# Altium schematic sheet IP2315.SchDoc
size A4
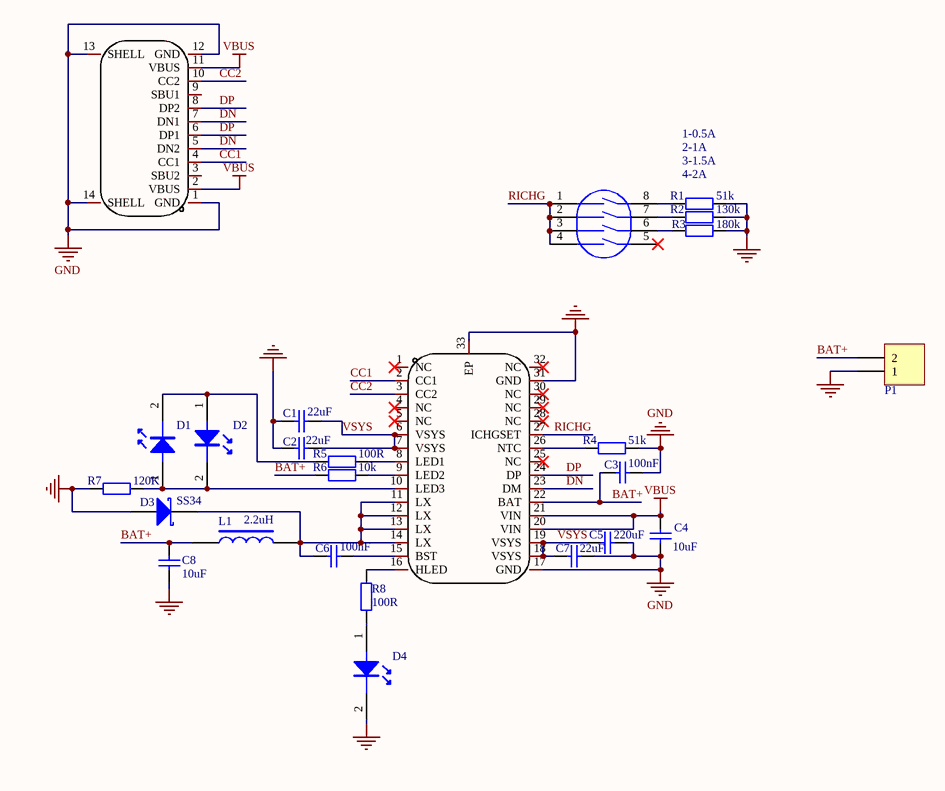
[diagram p0: IP2315.SchDoc]

## Parts
C1  value 22uF  [0805C]  (hidden comment: Cap)
C2  value 22uF  [0805C]  (hidden comment: Cap)
C3  value 100nF  [C0603]  (hidden comment: Cap)
C4  value 10uF  [0805C]  (hidden comment: Cap)
C5  value 220uF  [CAP-SMD_BD6.3-L6.6-W6.6-LS7.4-FD]  (hidden comment: Cap)
C6  value 100nF  [C0603]  (hidden comment: Cap)
C7  value 22uF  [0805C]  (hidden comment: Cap)
C8  value 10uF  [0805C]  (hidden comment: Cap)
D1  Green  [LED0603-RD_RED]  (value not drawn)
D2  Green  [LED0603-RD_RED]  (value not drawn)
D3  SS34  [SMA_L4.3-W2.5-LS5.0-RD]
D4  Green  [LED0603-RD_RED]  (value not drawn)
L1  2.2uH  [IND-SMD_L4.4-W4.2]
P1  VREF_SEL  [XH-2P-2.5]  (value not drawn)
R1  51k  [R0603]
R2  130k  [R0603]
R3  180k  [R0603]
R4  51k  [R0603]
R5  100R  [R0603]
R6  10k  [R0603]
R7  120K  [R0603]
R8  100R  [R0603]
SW1  DSHP04TS-S  [SW-SMD_8P-L6.7-W5.4-P1.27-LS8.5]  (value not drawn)
U1  IP2315  [QFN-32_L5.0-W5.0-P0.50-BL-EP3.4]  (value not drawn)
USB1  TYPE-C 16PIN 2MD(073)  [TYPE-C-16PIN-2MD-073]  (value not drawn)

## Nets
GND: C1.2 C2.2 C3.1 C4.1 C5.1 C7.1 C8.2 D3.1(A) D4.2 P1.1 R1.2 R2.2 R3.2 R4.2 R7.1 U1.17(GND) U1.31(GND) U1.33(EP) USB1.1(GND) USB1.12(GND) USB1.13(SHELL) USB1.14(SHELL)
VBUS: C4.2 U1.20(VIN) U1.21(VIN) USB1.2(VBUS) USB1.11(VBUS)
BAT+: C3.2 C8.1 L1.1 P1.2 R6.1 U1.22(BAT)
CC1: U1.2(CC1) USB1.4(CC1)
CC2: U1.3(CC2) USB1.10(CC2)
DN: U1.23(DM) USB1.5(DN2) USB1.7(DN1)
DP: U1.24(DP) USB1.6(DP1) USB1.8(DP2)
RICHG: SW1.1 SW1.2 SW1.3 SW1.4 U1.27(ICHGSET)
VSYS: C1.1 C2.1 C5.2 C7.2 U1.6(VSYS) U1.7(VSYS) U1.18(VSYS) U1.19(VSYS)
NetC6_1: C6.1 U1.15(BST)
NetC6_2: C6.2 D3.2(K) L1.2 U1.11(LX) U1.12(LX) U1.13(LX) U1.14(LX)
NetD1_1: D1.1 D2.2 R7.2 U1.10(LED3)
NetD1_2: D1.2 D2.1 R5.1
NetD4_1: D4.1 R8.1
NetR1_1: R1.1 SW1.8
NetR2_1: R2.1 SW1.7
NetR3_1: R3.1 SW1.6
NetR4_1: R4.1 U1.26(NTC)
NetR5_2: R5.2 U1.8(LED1)
NetR6_2: R6.2 U1.9(LED2)
NetR8_2: R8.2 U1.16(HLED)

Not connected (* = marked no-connect by the designer): SW1 5*; U1 1(NC)* 4(NC)* 5(NC)* 25(NC)* 28(NC)* 29(NC)* 30(NC)* 32(NC)*; USB1 3(SBU2) 9(SBU1)

## Notes on the sheet
- 1-0.5A
- 2-1A
- 3-1.5A
- 4-2A
- Title
- Size:
- Date:
- A4
- Number:
- Time:
- Revision:
- Sheet
- of
- File:

## Library data of the parts
C1-C4 C6-C8 = Cap_3: Capacitor; Published: 8-Jun-2000; LatestRevisionDate: 17-Jul-2002; LatestRevisionNote: Re-released for DXP Platform.; PackageReference: RAD-0.3; Publisher: Altium Limited; PackageDescription: Radial Cap, Thru-Hole; 2 Leads; 0.3 in Pin Spacing
C5 = Cap_3: Capacitor; pin to pad: 1>2 2>1; Published: 8-Jun-2000; LatestRevisionDate: 17-Jul-2002; LatestRevisionNote: Re-released for DXP Platform.; PackageReference: RAD-0.3; Publisher: Altium Limited; PackageDescription: Radial Cap, Thru-Hole; 2 Leads; 0.3 in Pin Spacing
D1 D2 D4 = LED: pin to pad: 1>2 2>1
D3 = SS34: 肖特基二极管; 属性: 40V/3A; BOM名称: 肖特基二极管; 封装库来自淘宝 ID：黄晶宝石: https://shop463601444.taobao.com
L1 = INDUCTLR2_1: C167206
P1 = Header 2: Header, 2-Pin; LatestRevisionDate: 17-Jul-2002; LatestRevisionNote: Re-released for DXP Platform.; Publisher: Altium Limited
R1 R4-R8 = Res2: 500mA; Published: 8-Jun-2000; LatestRevisionDate: 17-Jul-2002; LatestRevisionNote: Re-released for DXP Platform.; PackageReference: AXIAL-0.4; Publisher: Altium Limited; PackageDescription: Axial Device, Thru-Hole; 2 Leads; 0.4 in Pin Spacing
  R1 R4: Value: 51k
  R5 R8: Value: 100R
  R6: Value: 10k
  R7: Value: 120K
R2 R3 = Res2: Resistor; Published: 8-Jun-2000; LatestRevisionDate: 17-Jul-2002; LatestRevisionNote: Re-released for DXP Platform.; PackageReference: AXIAL-0.4; Publisher: Altium Limited; PackageDescription: Axial Device, Thru-Hole; 2 Leads; 0.4 in Pin Spacing
  R2: Value: 130k
  R3: Value: 180k
SW1 = DSHP04TS-S: Manufacturer: XKB Connectivity(中国星坤); Add into BOM: yes; Circuit: 单刀单掷; Number of Positions: 4位; Pin Style: 鸥翼型; Current Rating: 25mA; Voltage Rating: 24V; Operating Life: 3千次; Name: DSHP04TS-S; Symbol: DSHP04TS-S; Device: DSHP04TS-S; LCSC Part Name: 间距1.27mm 平拨,凹槽式 4位拨码开关; Supplier Part: C319050; Manufacturer Part: DSHP04TS-S; Supplier Footprint: SMD-8P,5.4x6.7mm; JLCPCB Part Class: Extended Part; Datasheet: https://atta.szlcsc.com/upload/public/pdf/source/20211009/11BE85C99D2C85B0991AF4F9D6EB8BDE.pdf; Supplier: LCSC; Convert to PCB: yes; Type: 平拨,凹槽式; Lead Pitch: 1.27mm; Operating Temperature: -20℃~+70℃; Color: 黑色
U1 = IP2315: Manufacturer: INJOINIC(英集芯); Add into BOM: yes; Name: IP2315; Symbol: IP2315; Device: IP2315; LCSC Part Name: IP2315; Supplier Part: C2764357; Manufacturer Part: IP2315; Supplier Footprint: QFN-32-EP(5x5); JLCPCB Part Class: Extended Part; Supplier: LCSC; Convert to PCB: yes
USB1 = TYPE-C 16PIN 2MD(073): Manufacturer: SHOU HAN(首韩); Add into BOM: yes; Gender: 母; Number of Ports: 1; Number of Contacts: 16P; Current Rating - Power (Max): 5A; Name: TYPE-C 16PIN 2MD(073); Symbol: TYPE-C 16PIN 2MD(073); Device: TYPE-C 16PIN 2MD(073); LCSC Part Name: Type-C 母 卧贴; Supplier Part: C2765186; Manufacturer Part: TYPE-C 16PIN 2MD(073); Supplier Footprint: SMD; JLCPCB Part Class: Extended Part; Datasheet: https://atta.szlcsc.com/upload/public/pdf/source/20211123/39B17C16241EAC15C5E277BDA434118E.pdf; Supplier: LCSC; Convert to PCB: yes; Connector Type: Type-C; Standard: -; Mounting Style: 卧贴; Operating Temperature Range: -25℃~+85℃